# Altium schematic sheet Top_Level_3.SchDoc
size 381 x 241 mm
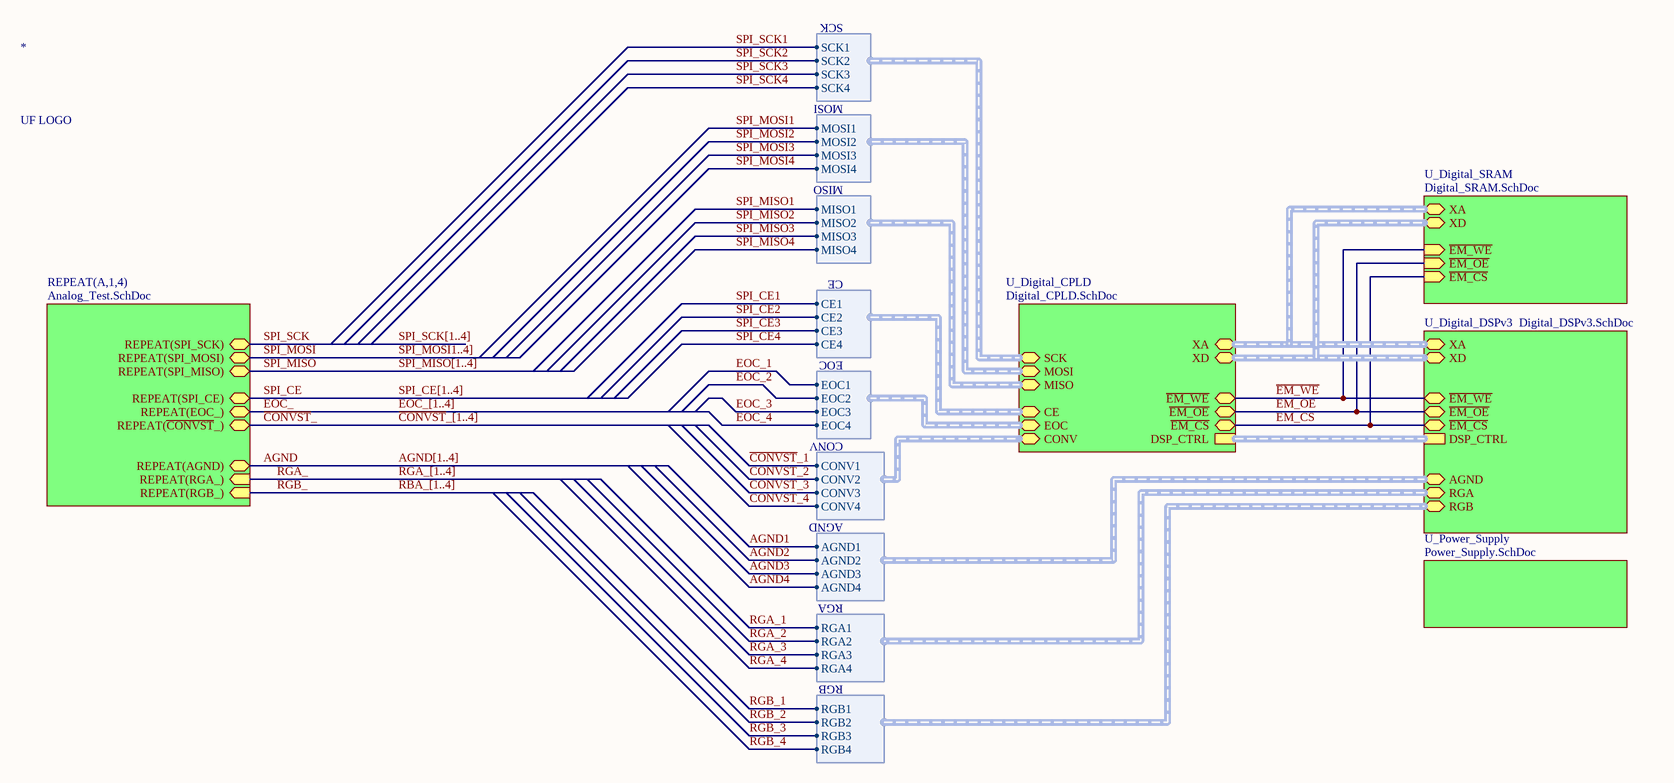
[diagram p0: Top_Level_3.SchDoc]

## Parts
*  UF LOGO  [UF LOGO-1000]
MIL  MIL LOGO  [MIL LOGO - 500]  (value not drawn)

## Sub-sheets
REPEAT(A,1,4) = Analog_Test.SchDoc: REPEAT(RGA_) (in), REPEAT(RGB_) (in), REPEAT(SPI_SCK) (bidir), REPEAT(SPI_MISO) (bidir), REPEAT(SPI_CE) (bidir), REPEAT(~{CONVST}_) (bidir), REPEAT(EOC_) (bidir), REPEAT(AGND) (bidir), REPEAT(SPI_MOSI) (bidir)
U_Digital_CPLD = Digital_CPLD.SchDoc: ~{EM_OE} (bidir), ~{EM_CS} (bidir), ~{EM_WE} (bidir), DSP_CTRL (harness DSP_CTRL), XA (harness XA), XD (harness XD), SCK (harness SCK), MOSI (harness MOSI), MISO (harness MISO), CE (harness CE), EOC (harness EOC), CONV (harness CONV)
U_Digital_DSPv3 = Digital_DSPv3.SchDoc: ~{EM_WE} (bidir), ~{EM_OE} (bidir), ~{EM_CS} (bidir), DSP_CTRL (harness DSP_CTRL), XA (harness XA), XD (harness XD), AGND (harness AGND), RGA (harness RGA), RGB (harness RGB)
U_Digital_SRAM = Digital_SRAM.SchDoc: ~{EM_CS} (in), ~{EM_WE} (in), ~{EM_OE} (in), XD (harness XD), XA (harness XA)
U_Power_Supply = Power_Supply.SchDoc: no entries

## Harnesses
SCK: SCK1, SCK2, SCK3, SCK4
MOSI: MOSI1, MOSI2, MOSI3, MOSI4
MISO: MISO1, MISO2, MISO3, MISO4
CE: CE1, CE2, CE3, CE4
EOC: EOC1, EOC2, EOC3, EOC4
CONV: CONV1, CONV2, CONV3, CONV4
AGND: AGND1, AGND2, AGND3, AGND4
RGA: RGA1, RGA2, RGA3, RGA4
RGB: RGB1, RGB2, RGB3, RGB4

## Nets
AGND: sheet REPEAT(A,1,4)/REPEAT(AGND)
AGND1: sheet U_Digital_DSPv3/AGND.AGND1
AGND2: sheet U_Digital_DSPv3/AGND.AGND2
AGND3: sheet U_Digital_DSPv3/AGND.AGND3
AGND4: sheet U_Digital_DSPv3/AGND.AGND4
~{CONVST}_: sheet REPEAT(A,1,4)/REPEAT(~{CONVST}_)
~{CONVST}_1: sheet U_Digital_CPLD/CONV.CONV1
~{CONVST}_2: sheet U_Digital_CPLD/CONV.CONV2
~{CONVST}_3: sheet U_Digital_CPLD/CONV.CONV3
~{CONVST}_4: sheet U_Digital_CPLD/CONV.CONV4
~{EM_CS}: sheet U_Digital_DSPv3/~{EM_CS}, sheet U_Digital_SRAM/~{EM_CS}, sheet U_Digital_CPLD/~{EM_CS}
~{EM_OE}: sheet U_Digital_DSPv3/~{EM_OE}, sheet U_Digital_SRAM/~{EM_OE}, sheet U_Digital_CPLD/~{EM_OE}
~{EM_WE}: sheet U_Digital_DSPv3/~{EM_WE}, sheet U_Digital_SRAM/~{EM_WE}, sheet U_Digital_CPLD/~{EM_WE}
EOC_: sheet REPEAT(A,1,4)/REPEAT(EOC_)
EOC_1: sheet U_Digital_CPLD/EOC.EOC1
EOC_2: sheet U_Digital_CPLD/EOC.EOC2
EOC_3: sheet U_Digital_CPLD/EOC.EOC3
EOC_4: sheet U_Digital_CPLD/EOC.EOC4
RGA_: sheet REPEAT(A,1,4)/REPEAT(RGA_)
RGA_1: sheet U_Digital_DSPv3/RGA.RGA1
RGA_2: sheet U_Digital_DSPv3/RGA.RGA2
RGA_3: sheet U_Digital_DSPv3/RGA.RGA3
RGA_4: sheet U_Digital_DSPv3/RGA.RGA4
RGB_: sheet REPEAT(A,1,4)/REPEAT(RGB_)
RGB_1: sheet U_Digital_DSPv3/RGB.RGB1
RGB_2: sheet U_Digital_DSPv3/RGB.RGB2
RGB_3: sheet U_Digital_DSPv3/RGB.RGB3
RGB_4: sheet U_Digital_DSPv3/RGB.RGB4
SPI_CE: sheet REPEAT(A,1,4)/REPEAT(SPI_CE)
SPI_CE1: sheet U_Digital_CPLD/CE.CE1
SPI_CE2: sheet U_Digital_CPLD/CE.CE2
SPI_CE3: sheet U_Digital_CPLD/CE.CE3
SPI_CE4: sheet U_Digital_CPLD/CE.CE4
SPI_MISO: sheet REPEAT(A,1,4)/REPEAT(SPI_MISO)
SPI_MISO1: sheet U_Digital_CPLD/MISO.MISO1
SPI_MISO2: sheet U_Digital_CPLD/MISO.MISO2
SPI_MISO3: sheet U_Digital_CPLD/MISO.MISO3
SPI_MISO4: sheet U_Digital_CPLD/MISO.MISO4
SPI_MOSI: sheet REPEAT(A,1,4)/REPEAT(SPI_MOSI)
SPI_MOSI1: sheet U_Digital_CPLD/MOSI.MOSI1
SPI_MOSI2: sheet U_Digital_CPLD/MOSI.MOSI2
SPI_MOSI3: sheet U_Digital_CPLD/MOSI.MOSI3
SPI_MOSI4: sheet U_Digital_CPLD/MOSI.MOSI4
SPI_SCK: sheet REPEAT(A,1,4)/REPEAT(SPI_SCK)
SPI_SCK1: sheet U_Digital_CPLD/SCK.SCK1
SPI_SCK2: sheet U_Digital_CPLD/SCK.SCK2
SPI_SCK3: sheet U_Digital_CPLD/SCK.SCK3
SPI_SCK4: sheet U_Digital_CPLD/SCK.SCK4

## Buses and harness runs
bus AGND[1..4]
bus EOC_[1..4]
bus RBA_[1..4]
bus RGA_[1..4]
bus SPI_CE[1..4]
bus SPI_MISO[1..4]
bus SPI_MOSI1..4]
bus SPI_SCK[1..4]
bus ~{CONVST}_[1..4]
harness sheet U_Digital_CPLD/DSP_CTRL = sheet U_Digital_DSPv3/DSP_CTRL
harness sheet U_Digital_CPLD/XA = sheet U_Digital_DSPv3/XA = sheet U_Digital_SRAM/XA
harness sheet U_Digital_CPLD/XD = sheet U_Digital_DSPv3/XD = sheet U_Digital_SRAM/XD